# EAGLE design M121D (EAGLE 6.6.0)
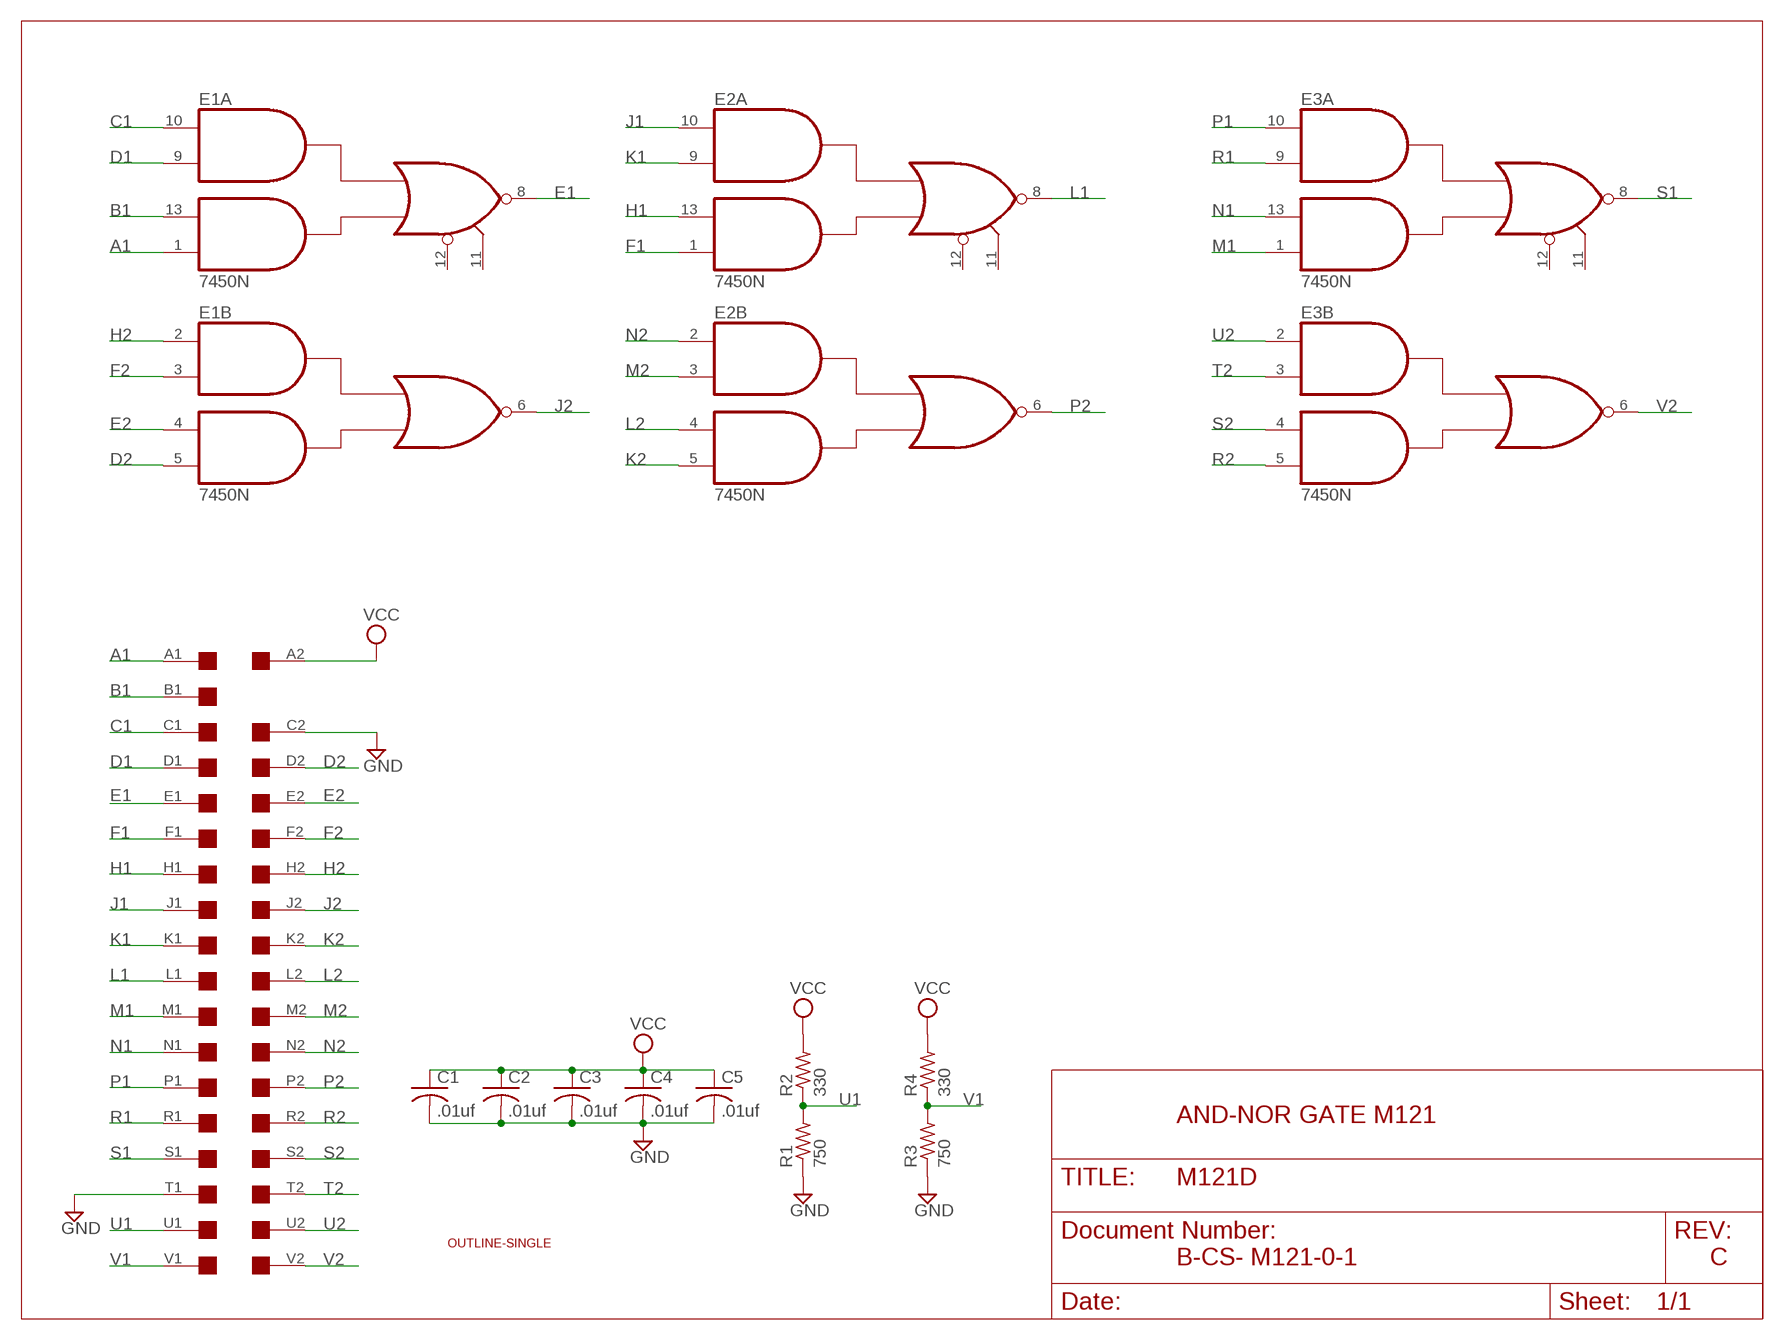
[diagram p0: schematic, sheet 1]

## Parts
C1  .01uf  C-US050-025X075  [C050-025X075]
C2  .01uf  C-US050-025X075  [C050-025X075]
C3  .01uf  C-US050-025X075  [C050-025X075]
C4  .01uf  C-US050-025X075  [C050-025X075]
C5  .01uf  C-US050-025X075  [C050-025X075]
E1  7450N  [DIL14]
E2  7450N  [DIL14]
E3  7450N  [DIL14]
R1  750  R-US_0207/10  [0207/10]
R2  330  R-US_0207/10  [0207/10]
R3  750  R-US_0207/10  [0207/10]
R4  330  R-US_0207/10  [0207/10]
U$1  OUTLINE-SINGLE  [SINGLE]
U$4  SINGLE  [EDGE-CON2]

## Nets
A1: E1.1(A:I4) U$4.A1
B1: E1.13(A:I3) U$4.B1
C1: E1.10(A:I1) U$4.C1
D1: E1.9(A:I2) U$4.D1
D2: E1.5(B:I4) U$4.D2
E1: E1.8(A:O) U$4.E1
E2: E1.4(B:I3) U$4.E2
F1: E2.1(A:I4) U$4.F1
F2: E1.3(B:I2) U$4.F2
GND [Supply]: C1.2 C2.2 C3.2 C4.2 C5.2 R1.1 R3.1 U$4.C2 U$4.T1
H1: E2.13(A:I3) U$4.H1
H2: E1.2(B:I1) U$4.H2
J1: E2.10(A:I1) U$4.J1
J2: E1.6(B:O) U$4.J2
K1: E2.9(A:I2) U$4.K1
K2: E2.5(B:I4) U$4.K2
L1: E2.8(A:O) U$4.L1
L2: E2.4(B:I3) U$4.L2
M1: E3.1(A:I4) U$4.M1
M2: E2.3(B:I2) U$4.M2
N1: E3.13(A:I3) U$4.N1
N2: E2.2(B:I1) U$4.N2
P1: E3.10(A:I1) U$4.P1
P2: E2.6(B:O) U$4.P2
R1: E3.9(A:I2) U$4.R1
R2: E3.5(B:I4) U$4.R2
S1: E3.8(A:O) U$4.S1
S2: E3.4(B:I3) U$4.S2
T2: E3.3(B:I2) U$4.T2
U1: R1.2 R2.1 U$4.U1
U2: E3.2(B:I1) U$4.U2
V1: R3.2 R4.1 U$4.V1
V2: E3.6(B:O) U$4.V2
VCC [Supply]: C1.1 C2.1 C3.1 C4.1 C5.1 R2.2 R4.2 U$4.A2
Unconnected: E1.11(A:I6) E1.12(A:I5) E2.11(A:I6) E2.12(A:I5) E3.11(A:I6) E3.12(A:I5) U$4.B2

## Notes on the sheet
- AND-NOR GATE M121
- B-CS- M121-0-1 | C

## Power pins joined to a net without a drawn wire
GND: E1.7(P:GND) E2.7(P:GND) E3.7(P:GND)
VCC: E1.14(P:VCC) E2.14(P:VCC) E3.14(P:VCC)

## Library data of the parts
C1-C5 = rcl:C-US: CAPACITOR, American symbol
E1-E3 = dec-con:74*50: 4-2-3-2 input AND OR INVERTER gates
R1-R4 = rcl:R-US_: RESISTOR, American symbol
U$1 = dec-con:OUTLINE-*: Board outlines for DEC boards.
U$4 = dec-con:SINGLE: Single-Height DEC board

## Net classes
1 Supply: width 0.813 mm

## Board
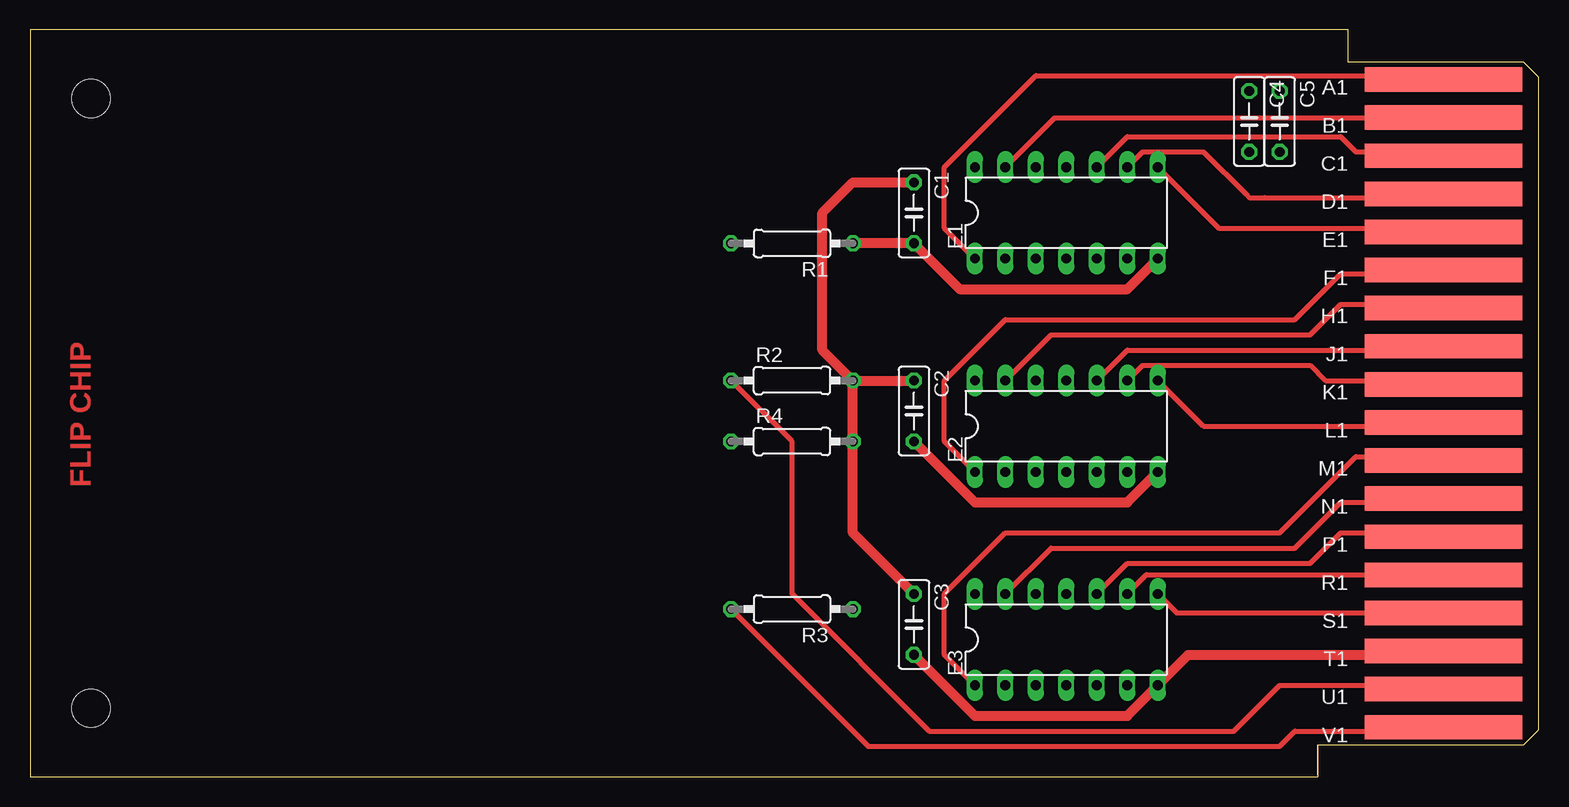
[diagram p1: board, top side]
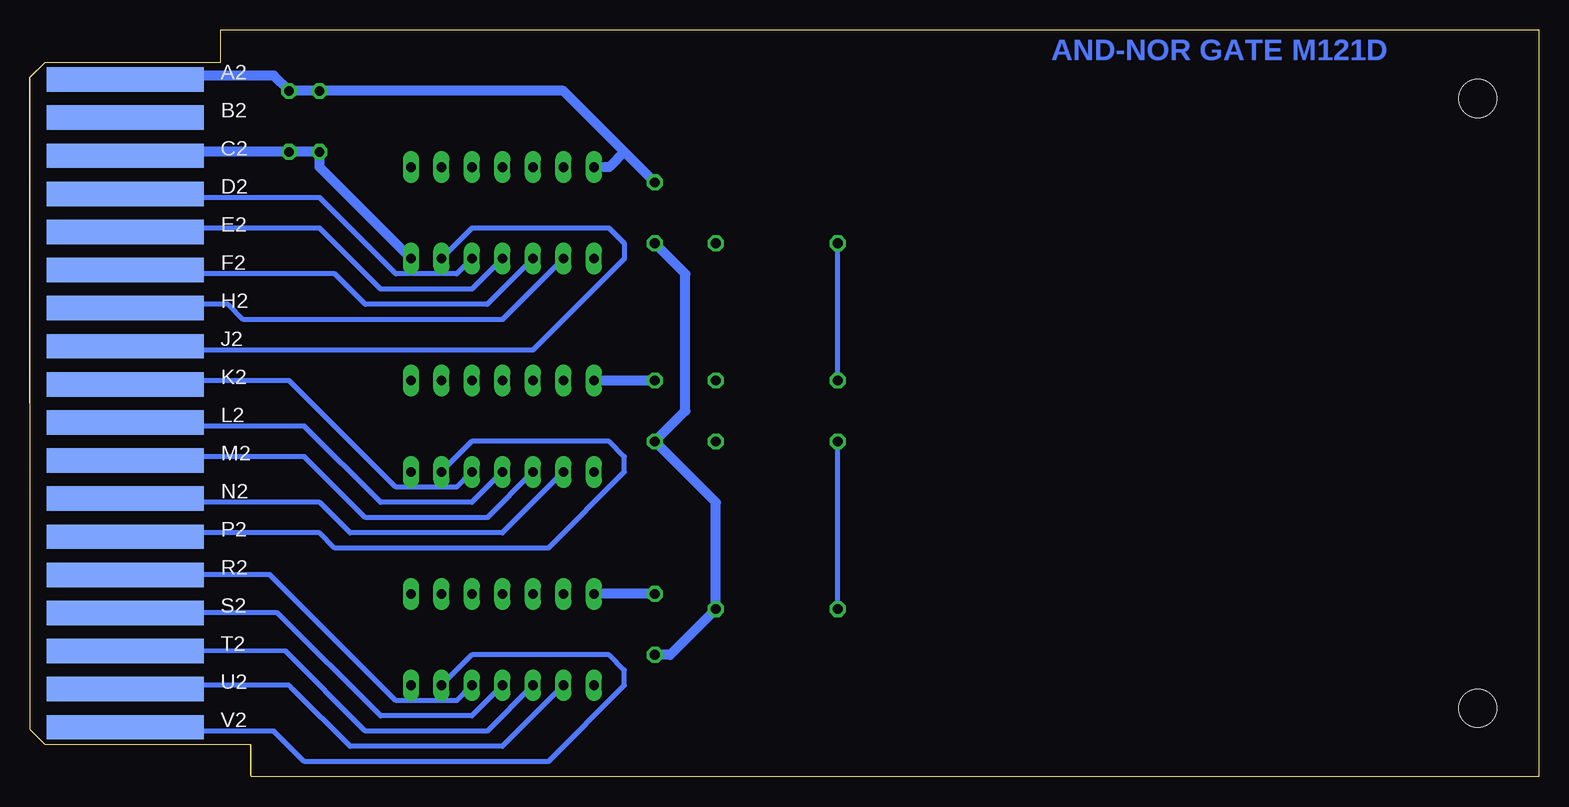
[diagram p2: board, bottom side, seen from below]

Size 125.73 x 62.23 mm. Coordinates in mm from the lower left corner, seen from the top.
Copper layers (1+16): Top 0.035mm / dielectric 1.5mm / Bottom 0.035mm
Design rules "16mils": minimum track width 16mil, minimum drill 32mil, track to track 15mil, track to pad 10mil, pad to pad 10mil, via to via 10mil, smd to smd 10mil, copper to edge 13mil, drill to drill 10mil, minimum pad ring 10mil, minimum via ring 8mil, stop-mask expansion 0mil, vias tented up to drill 0mil, thermal gap 10mil

### Footprints (pad centres in the part's own frame; a part is rotated, then mirrored left to right if it is on the bottom)
C050-025X075 = drill 0.813 octagon: 1 -2.54,0; 2 2.54,0
DIL14 = drill 0.813 long: 1 -7.62,-3.81; 2 -5.08,-3.81; 3 -2.54,-3.81; 4 0,-3.81; 5 2.54,-3.81; 6 5.08,-3.81; 7 7.62,-3.81; 8 7.62,3.81; 9 5.08,3.81; 10 2.54,3.81; 11 0,3.81; 12 -2.54,3.81; 13 -5.08,3.81; 14 -7.62,3.81
0207/10 = drill 0.813 octagon: 1 -5.08,0; 2 5.08,0
SINGLE = hole 3.175: 120.65,56.515; 120.65,5.715
EDGE-CON2 = smd 13.106 x 2.032: A1 7.938,4.128; B1 7.938,7.303; C1 7.938,10.477; D1 7.938,13.652; E1 7.938,16.828; F1 7.938,20.003; H1 7.938,23.177; J1 7.938,26.352; K1 7.938,29.527; L1 7.938,32.703; M1 7.938,35.877; N1 7.938,39.053; P1 7.938,42.227; R1 7.938,45.403; S1 7.938,48.578; T1 7.938,51.752; U1 7.938,54.928; V1 7.938,58.102 | smd 13.106 x 2.032 bottom: A2 7.938,4.128; B2 7.938,7.303; C2 7.938,10.477; D2 7.938,13.652; E2 7.938,16.828; F2 7.938,20.003; H2 7.938,23.177; J2 7.938,26.352; K2 7.938,29.527; L2 7.938,32.703; M2 7.938,35.877; N2 7.938,39.053; P2 7.938,42.227; R2 7.938,45.403; S2 7.938,48.578; T2 7.938,51.752; U2 7.938,54.928; V2 7.938,58.102

### Placement (x,y rotation side)
C1  73.66,46.99 270 top
C2  73.66,30.48 270 top
C3  73.66,12.7 270 top
C4  101.6,54.61 270 top
C5  104.14,54.61 270 top
E1  86.36,46.99 0 top
E2  86.36,29.21 0 top
E3  86.36,11.43 0 top
R1  63.5,44.45 180 top
R2  63.5,33.02 0 top
R3  63.5,13.97 180 top
R4  63.5,27.94 0 top
U$1  125.73,62.23 180 top
U$4  125.73,62.23 180 top

### Tracks (layer width: path | path; a pad name or v marks a point on that pad's centre or on a via)
A1
  Top 0.406: U$4.A1 112.16,58.02 111.76,58.42 83.82,58.42 76.2,50.8 76.2,45.72 E1.1
B1
  Top 0.406: U$4.B1 85.38,54.9 E1.13
C1
  Top 0.406: U$4.C1 112.09,51.74 111.76,52.07 110.49,52.07 109.22,53.34 91.44,53.34 E1.10
D1
  Top 0.406: U$4.D1 112.06,48.56 111.76,48.26 102.87,48.26 101.6,48.26 101.3,48.56 97.79,52.07 92.71,52.07 E1.9
D2
  Bottom 0.406: E1.5 90.17,41.91 95.25,41.91 101.6,48.26 111.76,48.26 112.06,48.56 U$4.D2
E1
  Top 0.406: U$4.E1 112.09,45.39 111.76,45.72 99.06,45.72 E1.8
E2
  Bottom 0.406: E1.4 88.9,40.64 96.52,40.64 101.6,45.72 111.76,45.72 112.09,45.39 U$4.E2
F1
  Top 0.406: U$4.F1 113.03,41.91 109.22,41.91 105.41,38.1 81.28,38.1 76.2,33.02 76.2,27.94 E2.1
F2
  Bottom 0.406: E1.3 87.63,39.37 97.79,39.37 100.33,41.91 111.76,41.91 112.04,42.19 U$4.F2
GND
  Top 0.813: U$4.T1 112.09,10.49 111.76,10.16 96.52,10.16 E3.7 91.44,5.08 78.74,5.08 C3.2 | E2.7 91.44,22.86 78.74,22.86 C2.2 | E1.7 91.44,40.64 77.47,40.64 C1.2 R1.1
  Bottom 0.813: C1.2 71.12,41.91 71.12,30.48 C2.2 68.58,22.86 R3.1 72.39,10.16 C3.2 | U$4.C2 112.09,51.74 111.76,52.07 C5.2 C4.2 101.6,50.8 E1.7
H1
  Top 0.406: U$4.H1 112.09,39.04 111.76,39.37 109.22,39.37 106.68,36.83 85.09,36.83 E2.13
H2
  Bottom 0.406: E1.2 86.36,38.1 107.95,38.1 109.22,39.37 111.76,39.37 112.09,39.04 U$4.H2
J1
  Top 0.406: U$4.J1 112.09,35.89 111.76,35.56 91.44,35.56 E2.10
J2
  Bottom 0.406: U$4.J2 112.09,35.89 111.76,35.56 83.82,35.56 76.2,43.18 76.2,44.45 77.47,45.72 88.9,45.72 E1.6
K1
  Top 0.406: U$4.K1 112.06,32.72 111.76,33.02 107.95,33.02 106.68,34.29 92.71,34.29 E2.9
K2
  Bottom 0.406: E2.5 90.17,24.13 95.25,24.13 104.14,33.02 111.76,33.02 112.06,32.72 U$4.K2
L1
  Top 0.406: U$4.L1 112.09,29.54 111.76,29.21 97.79,29.21 E2.8
L2
  Bottom 0.406: E2.4 88.9,22.86 96.52,22.86 102.87,29.21 111.76,29.21 112.09,29.54 U$4.L2
M1
  Top 0.406: U$4.M1 112.09,26.34 111.76,26.67 110.49,26.67 104.14,20.32 81.28,20.32 76.2,15.24 76.2,10.16 E3.1
M2
  Bottom 0.406: E2.3 87.63,21.59 97.79,21.59 102.87,26.67 111.76,26.67 112.09,26.34 U$4.M2
N1
  Top 0.406: U$4.N1 111.76,22.86 109.22,22.86 105.41,19.05 85.09,19.05 E3.13
N2
  Bottom 0.406: E2.2 86.36,20.32 99.06,20.32 101.6,22.86 111.76,22.86 112.09,23.19 U$4.N2
P1
  Top 0.406: U$4.P1 112.09,19.99 111.76,20.32 109.22,20.32 106.68,17.78 91.44,17.78 E3.10
P2
  Bottom 0.406: U$4.P2 112.09,19.99 111.76,20.32 101.6,20.32 100.33,19.05 82.55,19.05 76.2,25.4 76.2,26.67 77.47,27.94 88.9,27.94 E2.6
R1
  Top 0.406: U$4.R1 93.04,16.84 E3.9
R2
  Bottom 0.406: U$4.R2 105.74,16.84 95.25,6.35 90.17,6.35 E3.5
S1
  Top 0.406: U$4.S1 95.56,13.66 E3.8
S2
  Bottom 0.406: U$4.S2 105.11,13.66 96.52,5.08 88.9,5.08 E3.4
T2
  Bottom 0.406: U$4.T2 104.47,10.49 97.79,3.81 87.63,3.81 E3.3
U1
  Top 0.406: U$4.U1 112.12,7.26 111.76,7.62 104.14,7.62 100.33,3.81 74.93,3.81 63.5,15.24 63.5,27.94 R2.1
  Bottom 0.406: R2.1 R1.2
U2
  Bottom 0.406: U$4.U2 112.12,7.26 111.76,7.62 104.14,7.62 103.78,7.26 99.06,2.54 86.36,2.54 E3.2
V1
  Top 0.406: U$4.V1 112.15,4.2 111.76,3.81 105.41,3.81 104.14,2.54 69.85,2.54 R3.2
  Bottom 0.406: R3.2 R4.1
V2
  Bottom 0.406: U$4.V2 111.76,4.2 111.76,3.81 105.41,3.81 102.87,1.27 82.55,1.27 76.2,7.62 76.2,8.89 77.47,10.16 88.9,10.16 E3.6
VCC
  Top 0.813: C3.1 68.58,20.32 R4.2 R2.2 | R2.2 C2.1 | C1.1 68.58,49.53 66.04,46.99 66.04,35.56 R2.2
  Bottom 0.813: C3.1 E3.14 | C2.1 E2.14 | U$4.A2 112.16,58.02 111.76,58.42 105.41,58.42 C5.1 C4.1 81.28,57.15 76.2,52.07 | C1.1 76.2,52.07 | E1.14 77.47,50.8 76.2,52.07

### Text on the board
Top: FLIP CHIP
Bottom: AND-NOR GATE M121D